# EAGLE design Crowtail-I2C_Hub v0.9 (EAGLE 6.1)
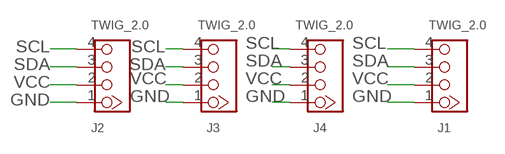
[diagram p0: schematic, sheet 1]

## Parts
J1  TWIG_2.0  [2.0_1X4]
J2  TWIG_2.0  [2.0_1X4]
J3  TWIG_2.0  [2.0_1X4]
J4  TWIG_2.0  [2.0_1X4]

## Nets
GND: J1.1 J2.1 J3.1 J4.1
SCL: J1.4 J2.4 J3.4 J4.4
SDA: J1.3 J2.3 J3.3 J4.3
VCC: J1.2 J2.2 J3.2 J4.2

## Library data of the parts
J1-J4 = CONNECTER:TWIG_2.0

## Net classes
0 default: width 0.203 mm, drill 0.305 mm, clearance 0.203 mm

## Board
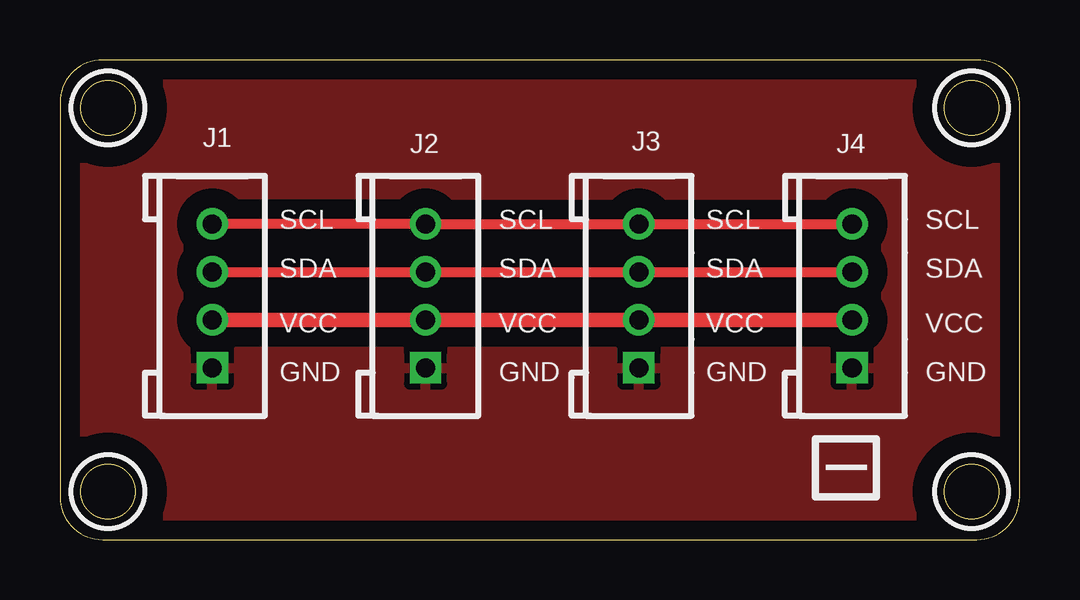
[diagram p1: board, top side]
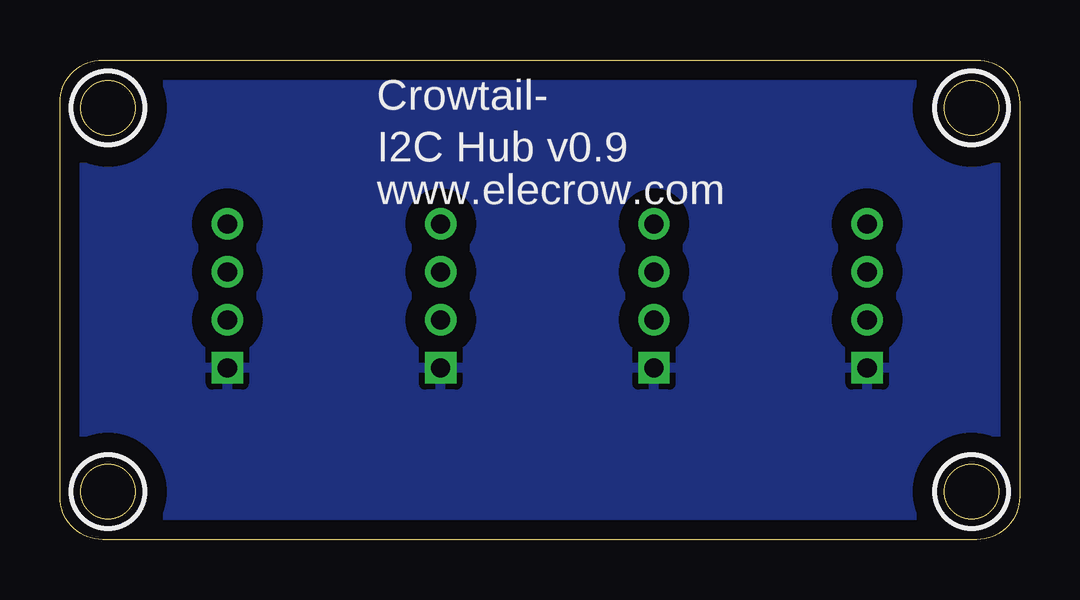
[diagram p2: board, bottom side, seen from below]

Size 40 x 20 mm. Coordinates in mm from the lower left corner, seen from the top.
Outline: 1.78,0 38.22,0 arc90 40,1.78 40,18.22 arc90 38.22,20 1.78,20 arc90 0,18.22 0,1.78 arc90 1.78,0
Outline: circle at 2,18 radius 1.14
Outline: circle at 2,2 radius 1.14
Outline: circle at 38,18 radius 1.14
Outline: circle at 38,2 radius 1.14
Copper layers (1*16): Top 0.035mm / dielectric 1.5mm / Bottom 0.035mm
Design rules: minimum track width 10mil, minimum drill 24mil, track to track 8mil, track to pad 8mil, pad to pad 8mil, via to via 8mil, smd to smd 0mil, copper to edge 20mil, drill to drill 8mil, minimum pad ring 10mil, minimum via ring 8mil, stop-mask expansion 4mil, vias tented up to drill 100mil, thermal gap 10mil
tRestrict: area 0.5,16.5 to 3.5,19.5; area 0.5,0.5 to 3.5,3.5; area 36.5,16.5 to 39.5,19.5; area 36.5,0.5 to 39.5,3.5
bRestrict: area 0.5,16.5 to 3.5,19.5; area 0.5,0.5 to 3.5,3.5; area 36.5,16.5 to 39.5,19.5; area 36.5,0.5 to 39.5,3.5

### Footprints (pad centres in the part's own frame; a part is rotated, then mirrored left to right if it is on the bottom)
2.0_1X4 = drill 0.8 pad 1.27 square: 1 -3,0 | drill 0.8 pad 1.27: 2 -1,0; 3 1,0; 4 3,0

### Placement (x,y rotation side)
J1  6.35,10.16 90 top
J2  15.24,10.16 90 top
J3  24.13,10.16 90 top
J4  33.02,10.16 90 top

### Tracks (layer width: path | path; a pad name or v marks a point on that pad's centre or on a via)
GND
  pour Bottom (isolate 0.813): -0.51,18.29 -0.51,1.52 arc90 1.52,-0.51 38.61,-0.51 arc90 40.64,1.52 40.64,18.29 arc90 38.61,20.32 1.52,20.32 arc90
  pour Top (isolate 0.813): 38.61,20.32 1.52,20.32 arc90 -0.51,18.29 -0.51,1.52 arc90 1.52,-0.51 38.61,-0.51 arc90 40.64,1.52 40.64,18.29 arc90
SCL
  Top 0.406: J1.4 J2.4 J3.4 J4.4
SDA
  Top 0.406: J1.3 J2.3 J3.3 J4.3
VCC
  Top 0.61: J1.2 J2.2 J3.2 J4.2

### Text on the board
tPlace: SCL | SCL | SCL | SCL | SDA | SDA | SDA | SDA | VCC | VCC | VCC | VCC | GND | GND | GND | GND | I
bPlace: Crowtail- | I2C Hub v0.9 | www.elecrow.com